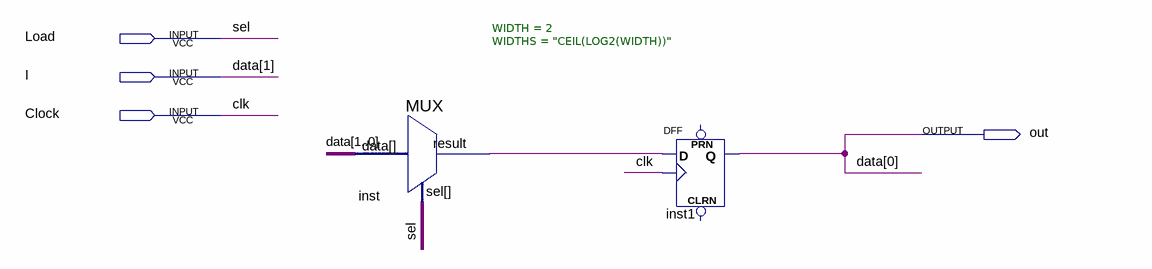
[diagram p0: schematic sheet]
// Quartus schematic register.bdf as structural Verilog: 2 symbols, 4 pins
module register (
  input  Load,
  input  I,
  input  Clock,
  output out
);

  wire inst_result;

  MUX #(.WIDTH(2), .WIDTHS("CEIL(LOG2(WIDTH))")) inst (.data({I, out}), .sel(Load), .result(inst_result));
  DFF inst1 (.CLK(Clock), .D(inst_result), .Q(out));  // open: CLRN, PRN

  // Other names for the same wires on the sheet: clk = Clock; data[1:0] = {I, out}; sel = Load
endmodule
